# EAGLE design SCD40Breakout (EAGLE 9.6.2)
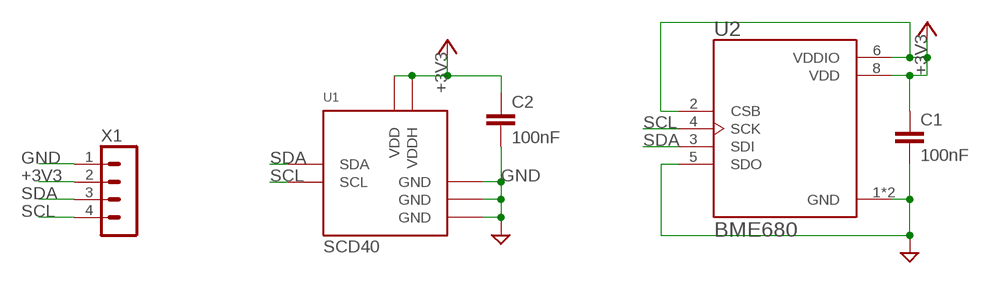
[diagram p0: schematic, sheet 1]

## Parts
C1  100nF  C-EUC0805  [C0805]
C2  100nF  C-EUC0805  [C0805]
U1  SCD40  [SCD40]
U2  BME680  [PSON80P300X300X100-8N]
X1  B4B-PH-K  [B4B-PH-K]

## Nets
+3V3: C1.1 C2.1 U1.P$7(VDD) U1.P$19(VDDH) U2.2(CSB) U2.6(VDDIO) U2.8(VDD) X1.2
GND: C1.2 C2.2 U1.P$6(GND) U1.P$20(GND) U1.P$21(GND) U2.1(GND) U2.5(SDO) U2.7(GND) X1.1
SCL: U1.P$9(SCL) U2.4(SCK) X1.4
SDA: U1.P$10(SDA) U2.3(SDI) X1.3

## Library data of the parts
C1 C2 = rcl:C-EU: CAPACITOR, European symbol; SPICEPREFIX: C
U1 = SCD40:SCD40
U2 = BME680:BME680: Integrated Environmental Unit Check prices <https://pricing.snapeda.com/parts/BME680/Bosch%20Sensortec/view-part?ref=eda>; AVAILABILITY: In Stock; DESCRIPTION: Gas, Humidity, Pressure, Temperature Sensor I²C, SPI Output; MF: Bosch Sensortec; MP: BME680; PACKAGE: LGA-8 Bosch Tools; PRICE: None; PURCHASE-URL: https://pricing.snapeda.com/search/part/BME680/?ref=eda
X1 = con-jst-ph:B4B-PH-K: HEADER

## Board
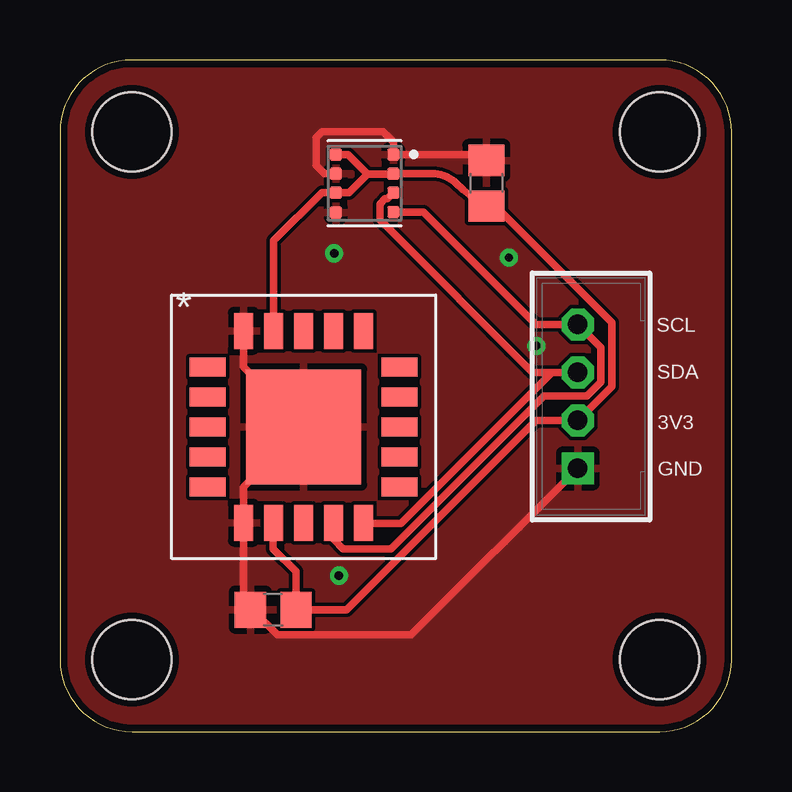
[diagram p1: board, top side]
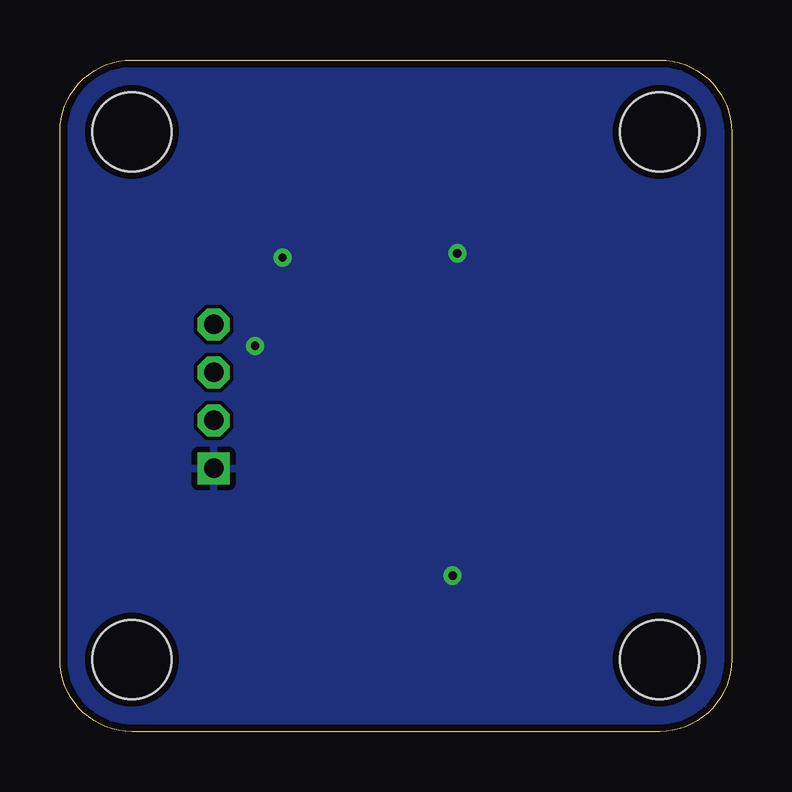
[diagram p2: board, bottom side, seen from below]

Size 28 x 28 mm. Coordinates in mm from the lower left corner, seen from the top.
Outline: 0,25 0,3 arc90 3,0 25,0 arc90 28,3 28,25 arc90 25,28 3,28 arc90 0,25
Copper layers (1*16): Top 0.035mm / dielectric 1.5mm / Bottom 0.035mm
Design rules "Seeed": minimum track width 6mil, minimum drill 0.3mm, track to track 6mil, track to pad 6mil, pad to pad 6mil, via to via 12mil, smd to smd 6mil, copper to edge 12mil, drill to drill 6mil, minimum pad ring 10mil, minimum via ring 8mil, stop-mask expansion 4mil, vias tented up to drill 20mil, thermal gap 10mil
Holes 3.3 mm at 3,3 25,3 25,25 3,25

### Footprints (pad centres in the part's own frame; a part is rotated, then mirrored left to right if it is on the bottom)
C0805 = smd 1.3 x 1.5: 1 -0.95,0; 2 0.95,0
SCD40 = smd 1.5 x 0.8: P$1 -4,2.5; P$2 -4,1.25; P$3 -4,0; P$4 -4,-1.25; P$5 -4,-2.5; P$11 4,-2.5; P$12 4,-1.25; P$13 4,0; P$14 4,1.25; P$15 4,2.5 | smd 0.8 x 1.5: P$6 -2.5,-4; P$7 -1.25,-4; P$8 0,-4; P$9 1.25,-4; P$10 2.5,-4; P$16 2.5,4; P$17 1.25,4; P$18 0,4; P$19 -1.25,4; P$20 -2.5,4 | smd 4.8 x 4.8: P$21 0,0
PSON80P300X300X100-8N = smd 0.5 x 0.5: 1 1.2,1.2; 2 1.2,0.4; 3 1.2,-0.4; 4 1.2,-1.2; 5 -1.2,-1.22; 6 -1.2,-0.4; 7 -1.2,0.4; 8 -1.2,1.2
B4B-PH-K = drill 0.813 square: 1 -3,0 | drill 0.813 octagon: 2 -1,0; 3 1,0; 4 3,0

### Placement (x,y rotation side)
C1  8.89,5.08 180 top
C2  17.78,22.86 90 top
U1  10.16,12.7 0 top
U2  12.7,22.86 0 top
X1  21.59,13.97 90 top

### Tracks (layer width: path | path; a pad name or v marks a point on that pad's centre or on a via)
+3V3
  Top 0.305: U2.8 12.01,24.06 12.83,23.24 | 12.83,23.24 13.88,23.24 U2.2 15.51,23.26 arc-44 16.51,22.86 arc14 C2.1 18.16,21.91 23.01,17.05 23.01,14.38 22.18,13.55 22.17,13.55 X1.2 19.84,12.97 11.95,5.08 C1.1 9.84,6.67 8.89,7.62 8.89,8.68 U1.P$7 | 12.83,23.24 12.05,22.46 U2.6 11.48,22.48 10.92,22.48 8.91,20.47 U1.P$19
GND  (via drill 0.35)
  Top 0.305: U1.P$20 7.66,15.2 U1.P$21 7.66,10.2 U1.P$6 7.66,5.36 C1.2 8.01,5.08 9.06,4.03 14.64,4.03 X1.1 | U2.7 11.03,23.26 10.67,23.62 10.67,24.77 10.92,25.02 13.46,25.02 13.9,24.58 U2.1 17.53,24.06 arc-90 C2.2
  other vias: 11.43,19.94 18.72,19.76 19.86,16.08 11.63,6.5
  pour Top: -1.27,-2.54 -1.27,29.21 30.48,29.21 30.48,-2.54
  pour Bottom: -1.27,-2.54 -1.27,29.21 30.48,29.21 30.48,-2.54
SCL
  Top 0.305: U1.P$9 11.41,8.02 11.81,7.62 13.81,7.62 20.17,13.98 21.96,13.98 22.55,14.57 22.55,16 X1.4 19.85,16.97 15.16,21.66 U2.4
SDA
  Top 0.305: U1.P$10 12.68,8.68 14.22,8.68 20.51,14.97 X1.3 19.7,14.97 13.57,21.11 13.56,21.11 13.35,21.32 13.35,22 13.56,22.21 13.65,22.21 U2.3

### Text on the board
tPlace: SCL | SDA | 3V3 | GND